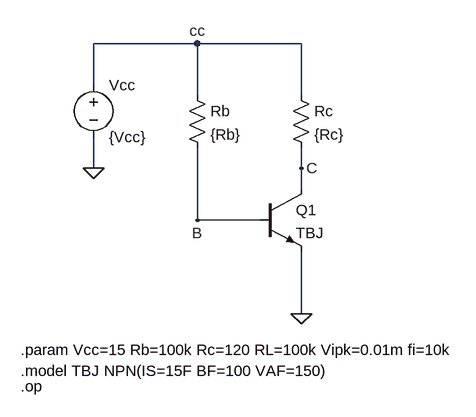
[diagram p0: schematic TBJ01CAop2.asc]
TBJ01CAop2.asc, the LTspice schematic file:
Version 4
SHEET 1 1608 1076
WIRE 128 -16 -32 -16
WIRE 288 -16 128 -16
WIRE -32 48 -32 -16
WIRE 128 64 128 -16
WIRE 288 64 288 -16
WIRE -32 176 -32 128
WIRE 288 176 288 144
WIRE 288 208 288 176
WIRE 128 256 128 144
WIRE 224 256 128 256
WIRE 288 400 288 304
FLAG -32 176 0
FLAG 288 400 0
FLAG 128 -16 cc
FLAG 128 256 B
FLAG 288 176 C
SYMBOL res 112 48 R0
SYMATTR InstName Rb
SYMATTR Value {Rb}
SYMBOL res 272 48 R0
SYMATTR InstName Rc
SYMATTR Value {Rc}
SYMBOL voltage -32 32 R0
WINDOW 123 0 0 Left 0
WINDOW 39 0 0 Left 0
SYMATTR InstName Vcc
SYMATTR Value {Vcc}
SYMBOL npn 224 208 R0
SYMATTR InstName Q1
SYMATTR Value TBJ
TEXT -144 456 Left 2 !.param Vcc=15 Rb=100k Rc=120 RL=100k Vipk=0.01m fi=10k
TEXT -144 512 Left 2 !.op
TEXT -144 488 Left 2 !.model TBJ NPN(IS=15F BF=100 VAF=150)

The netlist it stands for:
* TBJ01CAop2.asc
Rb cc B {Rb}
Rc cc C {Rc}
Vcc cc 0 {Vcc}
Q1 C B 0 0 TBJ
.model NPN NPN
.model PNP PNP
.lib standard.bjt
.param Vcc=15 Rb=100k Rc=120 RL=100k Vipk=0.01m fi=10k
.op
.model TBJ NPN(IS=15F BF=100 VAF=150)
.backanno
.end